# EAGLE board CFT-PB1 (EAGLE 5.11)
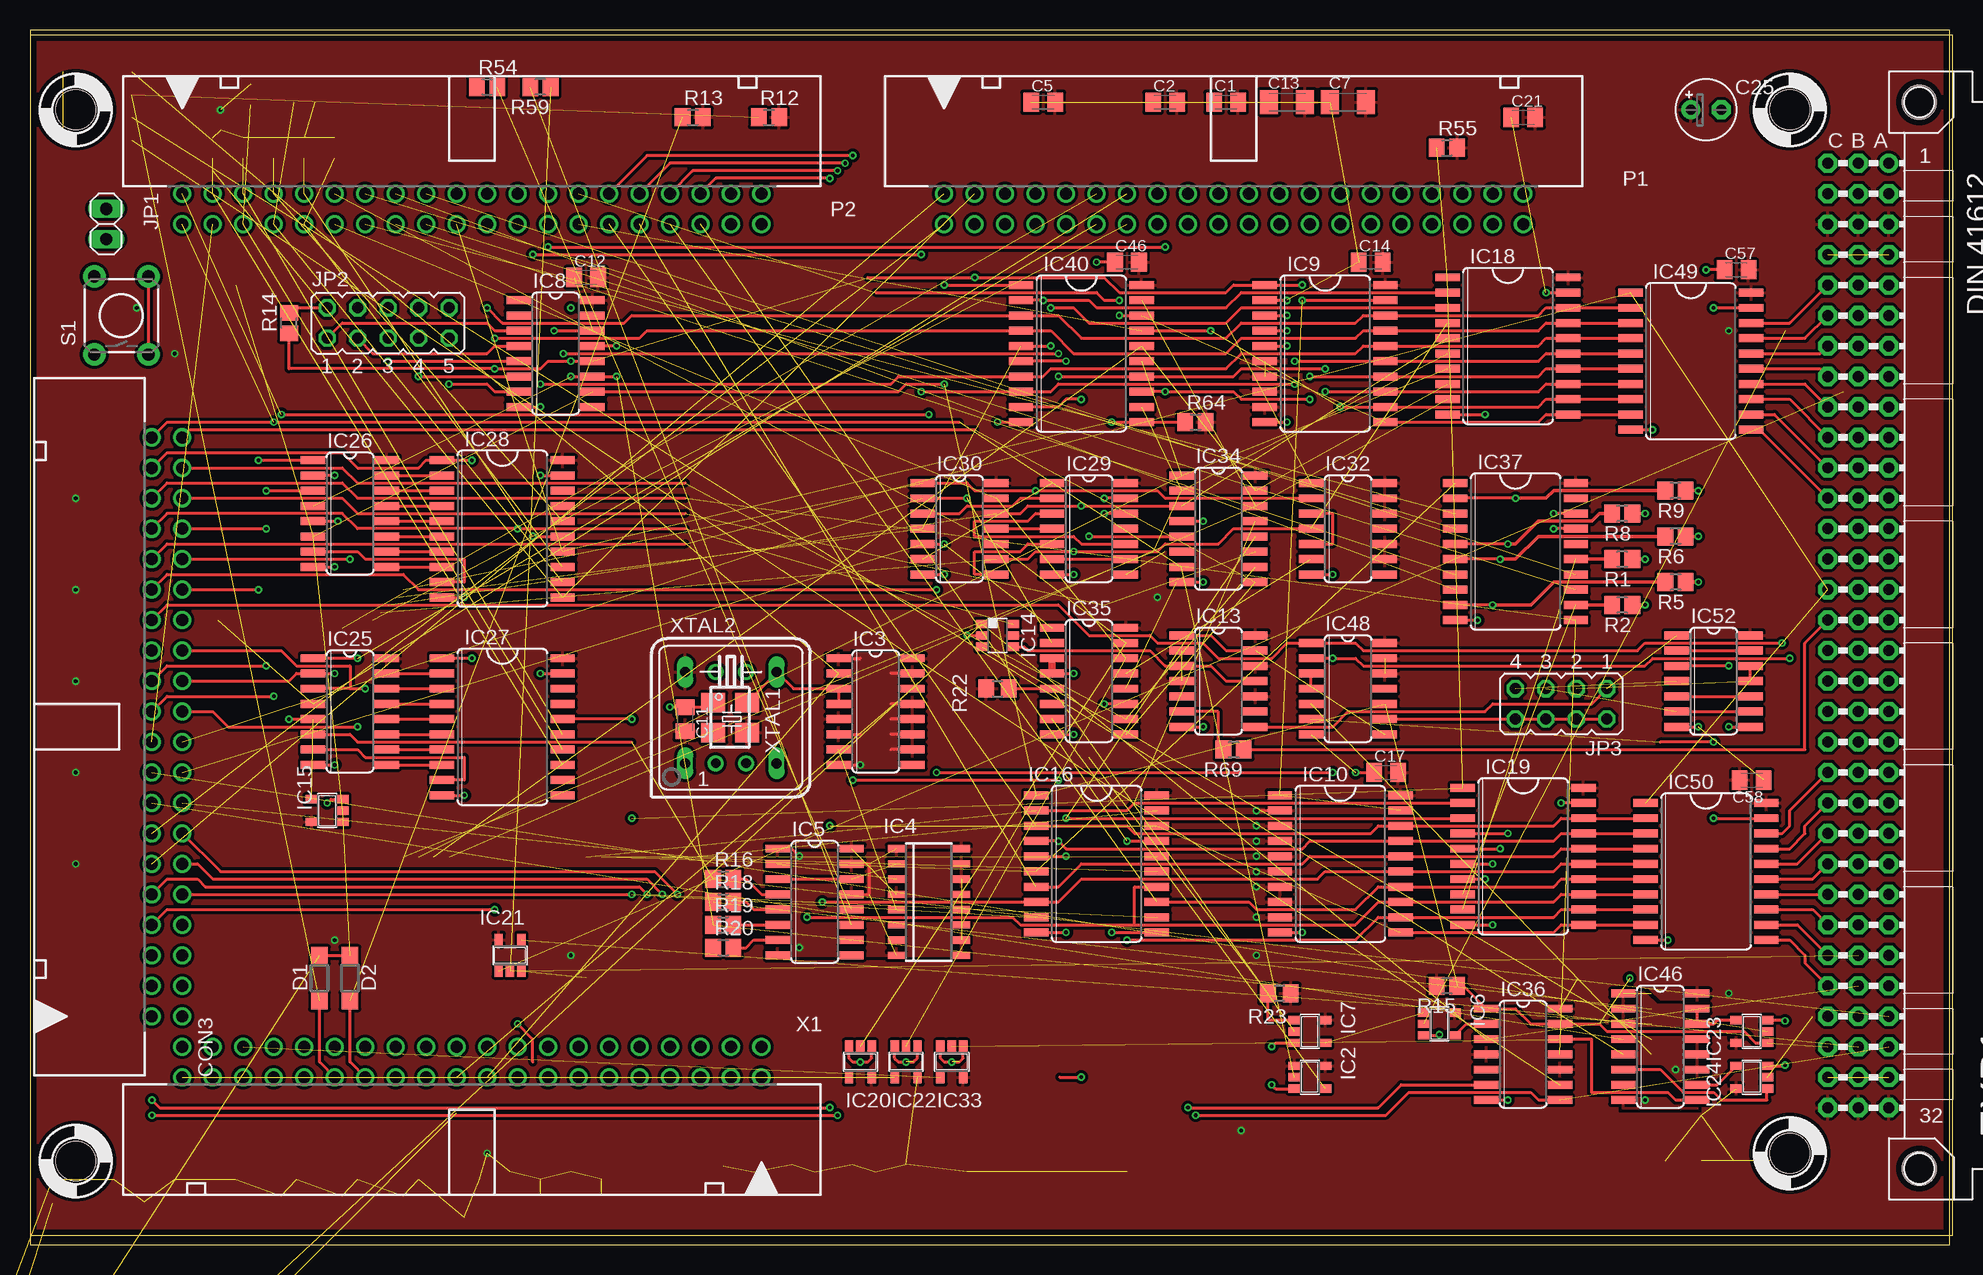
[diagram p11: board, top side]
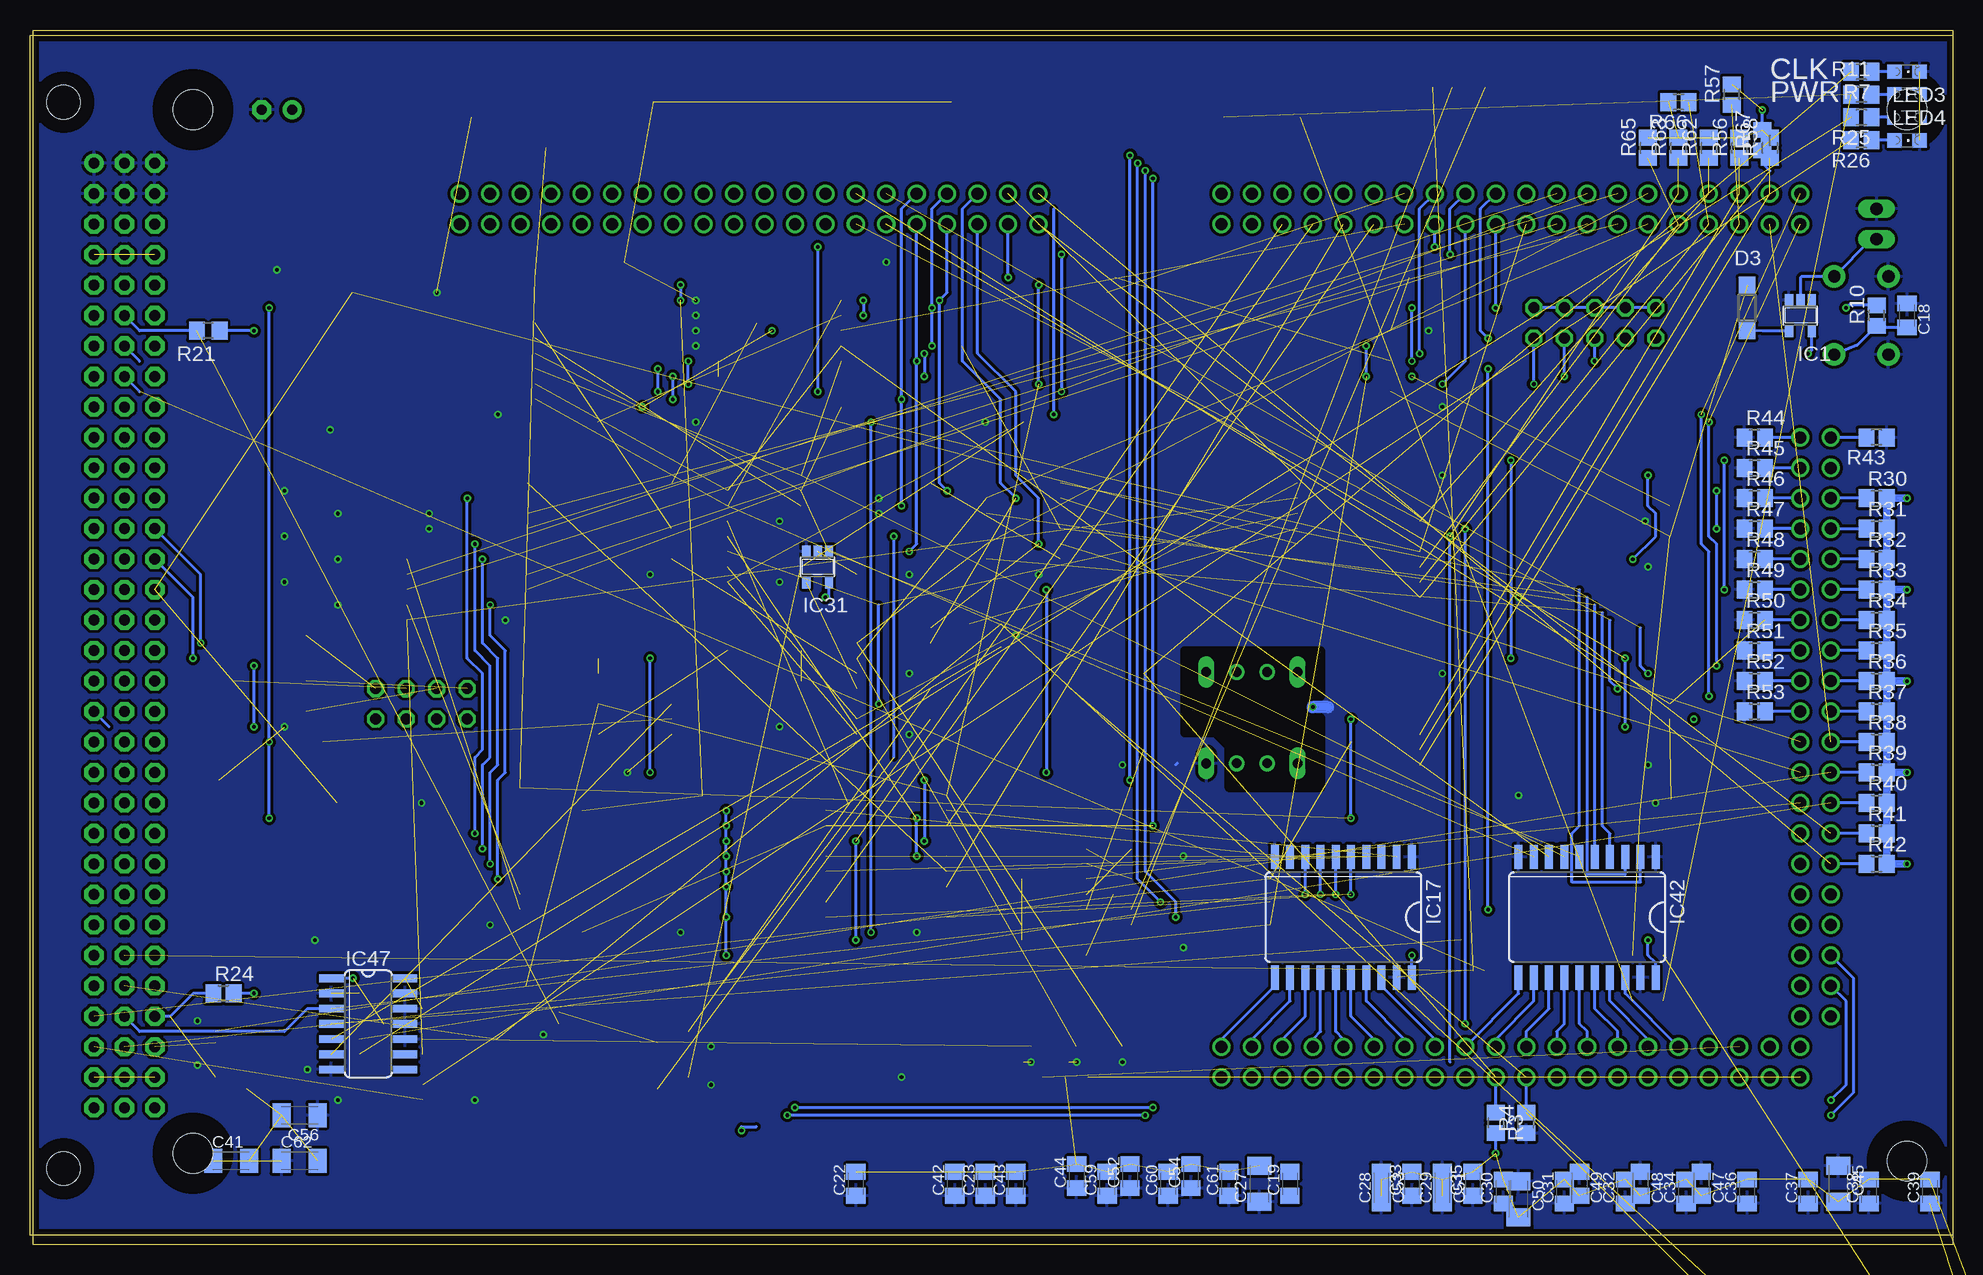
[diagram p12: board, bottom side, seen from below]

Size 160 x 101.27 mm. Coordinates in mm from the lower left corner, seen from the top.
Outline: 0,0 160,0 160,101.27 0,101.27 0,0
Copper layers (1*16): Top 0.035mm / dielectric 1.5mm / Bottom 0.035mm
Design rules "smart-prototyping": minimum track width 7mil, minimum drill 12mil, track to track 7mil, track to pad 7mil, pad to pad 7mil, via to via 7mil, smd to smd 0mil, copper to edge 20mil, drill to drill 10mil, minimum pad ring 10mil, minimum via ring 6mil, stop-mask expansion 2mil, vias tented up to drill 25mil, thermal gap 10mil
Net classes: 0 default: width 0.152 mm, clearance 0.152 mm; 1 low power: width 0.305 mm, clearance 0.152 mm; 2 LED power: width 0.406 mm, clearance 0.254 mm
bKeepout: area 52.7,38.1 to 64.1,49.5
bRestrict: area 52.7,38.1 to 64,49.5

## Footprints (pad centres in the part's own frame; a part is rotated, then mirrored left to right if it is on the bottom)
C0805K = smd 1.3 x 1.6: 1 -1,0; 2 1,0
C1206K = smd 1.5 x 2: 1 -1.5,0; 2 1.5,0
E2,5-5 = drill 0.813 pad 1.6 round: + -1.27,0 | drill 0.813 pad 1.6 octagon: - 1.27,0
PAK100/2500-5-40 = drill 1 pad 1.422 round: 1 -24.13,-1.27; 2 -24.13,1.27; 3 -21.59,-1.27; 4 -21.59,1.27; 5 -19.05,-1.27; 6 -19.05,1.27; 7 -16.51,-1.27; 8 -16.51,1.27; 9 -13.97,-1.27; 10 -13.97,1.27; 11 -11.43,-1.27; 12 -11.43,1.27; 13 -8.89,-1.27; 14 -8.89,1.27; 15 -6.35,-1.27; 16 -6.35,1.27; 17 -3.81,-1.27; 18 -3.81,1.27; 19 -1.27,-1.27; 20 -1.27,1.27; 21 1.27,-1.27; 22 1.27,1.27; 23 3.81,-1.27; 24 3.81,1.27; 25 6.35,-1.27; 26 6.35,1.27; 27 8.89,-1.27; 28 8.89,1.27; 29 11.43,-1.27; 30 11.43,1.27; 31 13.97,-1.27; 32 13.97,1.27; 33 16.51,-1.27; 34 16.51,1.27; 35 19.05,-1.27; 36 19.05,1.27; 37 21.59,-1.27; 38 21.59,1.27; 39 24.13,-1.27; 40 24.13,1.27
SOD123 = smd 1.4 x 1.4: A 1.9,0; C -1.9,0
VG96K = drill 0.914 pad 1.6 round: A1 154.94,39.37 | drill 0.914 pad 1.6 octagon: A2 154.94,36.83; A3 154.94,34.29; A4 154.94,31.75; A5 154.94,29.21; A6 154.94,26.67; A7 154.94,24.13; A8 154.94,21.59; A9 154.94,19.05; A10 154.94,16.51; A11 154.94,13.97; A12 154.94,11.43; A13 154.94,8.89; A14 154.94,6.35; A15 154.94,3.81; A16 154.94,1.27; A17 154.94,-1.27; A18 154.94,-3.81; A19 154.94,-6.35; A20 154.94,-8.89; A21 154.94,-11.43; A22 154.94,-13.97; A23 154.94,-16.51; A24 154.94,-19.05; A25 154.94,-21.59; A26 154.94,-24.13; A27 154.94,-26.67; A28 154.94,-29.21; A29 154.94,-31.75; A30 154.94,-34.29; A31 154.94,-36.83; A32 154.94,-39.37; B1 152.4,39.37; B2 152.4,36.83; B3 152.4,34.29; B4 152.4,31.75; B5 152.4,29.21; B6 152.4,26.67; B7 152.4,24.13; B8 152.4,21.59; B9 152.4,19.05; B10 152.4,16.51; B11 152.4,13.97; B12 152.4,11.43; B13 152.4,8.89; B14 152.4,6.35; B15 152.4,3.81; B16 152.4,1.27; B17 152.4,-1.27; B18 152.4,-3.81; B19 152.4,-6.35; B20 152.4,-8.89; B21 152.4,-11.43; B22 152.4,-13.97; B23 152.4,-16.51; B24 152.4,-19.05; B25 152.4,-21.59; B26 152.4,-24.13; B27 152.4,-26.67; B28 152.4,-29.21; B29 152.4,-31.75; B30 152.4,-34.29; B31 152.4,-36.83; B32 152.4,-39.37; C1 149.86,39.37; C2 149.86,36.83; C3 149.86,34.29; C4 149.86,31.75; C5 149.86,29.21; C6 149.86,26.67; C7 149.86,24.13; C8 149.86,21.59; C9 149.86,19.05; C10 149.86,16.51; C11 149.86,13.97; C12 149.86,11.43; C13 149.86,8.89; C14 149.86,6.35; C15 149.86,3.81; C16 149.86,1.27; C17 149.86,-1.27; C18 149.86,-3.81; C19 149.86,-6.35; C20 149.86,-8.89; C21 149.86,-11.43; C22 149.86,-13.97; C23 149.86,-16.51; C24 149.86,-19.05; C25 149.86,-21.59; C26 149.86,-24.13; C27 149.86,-26.67; C28 149.86,-29.21; C29 149.86,-31.75; C30 149.86,-34.29; C31 149.86,-36.83; C32 149.86,-39.37 | hole 2.794: 157.48,44.45; 157.48,-44.45
SOT23-5 = smd 0.69 x 0.99: 1 -0.95,-1.29; 2 0,-1.29; 3 0.95,-1.29; 4 0.95,1.3; 5 -0.95,1.3
SO16 = smd 0.66 x 2.032: 1 -4.445,-3.073; 2 -3.175,-3.073; 3 -1.905,-3.073; 4 -0.635,-3.073; 5 0.635,-3.073; 6 1.905,-3.073; 7 3.175,-3.073; 8 4.445,-3.073; 9 4.445,3.073; 10 3.175,3.073; 11 1.905,3.073; 12 0.635,3.073; 13 -0.635,3.073; 14 -1.905,3.073; 15 -3.175,3.073; 16 -4.445,3.073
SO16D = smd 0.6 x 1.4: 1 -4.445,-2.715; 2 -3.175,-2.715; 3 -1.905,-2.715; 4 -0.635,-2.715; 5 0.635,-2.715; 6 1.905,-2.715; 7 3.175,-2.715; 8 4.445,-2.715; 9 4.445,2.715; 10 3.175,2.715; 11 1.905,2.715; 12 0.635,2.715; 13 -0.635,2.715; 14 -1.905,2.715; 15 -3.175,2.715; 16 -4.445,2.715
SO20W = smd 0.66 x 2.032: 1 -5.715,-5.029; 2 -4.445,-5.029; 3 -3.175,-5.029; 4 -1.905,-5.029; 5 -0.635,-5.029; 6 0.635,-5.029; 7 1.905,-5.029; 8 3.175,-5.029; 9 4.445,-5.029; 10 5.715,-5.029; 11 5.715,5.029; 12 4.445,5.029; 13 3.175,5.029; 14 1.905,5.029; 15 0.635,5.029; 16 -0.635,5.029; 17 -1.905,5.029; 18 -3.175,5.029; 19 -4.445,5.029; 20 -5.715,5.029
SO14 = smd 0.66 x 2.032: 1 -3.81,-3.073; 2 -2.54,-3.073; 3 -1.27,-3.073; 4 0,-3.073; 5 1.27,-3.073; 6 2.54,-3.073; 7 3.81,-3.073; 8 3.81,3.073; 9 2.54,3.073; 10 1.27,3.073; 11 0,3.073; 12 -1.27,3.073; 13 -2.54,3.073; 14 -3.81,3.073
DBV_R-PDSO-G6 = smd 0.69 x 0.99: 1 -0.95,-1.29; 2 0,-1.29; 3 0.95,-1.29; 4 0.95,1.3; 5 0,1.3; 6 -0.95,1.3
1X02 = drill 1.016 long: 1 -1.27,0; 2 1.27,0
JP5Q = drill 0.914 octagon: 1 -5.08,-1.27; 2 -5.08,1.27; 3 -2.54,-1.27; 4 -2.54,1.27; 5 0,-1.27; 6 0,1.27; 7 2.54,-1.27; 8 2.54,1.27; 9 5.08,-1.27; 10 5.08,1.27
JP4Q = drill 0.914 octagon: 1 -3.81,-1.27; 2 -3.81,1.27; 3 -1.27,-1.27; 4 -1.27,1.27; 5 1.27,-1.27; 6 1.27,1.27; 7 3.81,-1.27; 8 3.81,1.27
CHIPLED_0805 = smd 1.2 x 1.2: A 0,-1.05; C 0,1.05
R0805 = smd 1.3 x 1.5: 1 -0.85,0; 2 0.85,0
R0805' = smd 1.3 x 1.5: 1 -0.95,0; 2 0.95,0
TACTILE-PTH = drill 1.016 pad 1.88 round: 1 -3.251,2.261; 2 3.251,2.261; 3 -3.251,-2.261; 4 3.251,-2.261
STANDOFF_28_60 = hole 3.302: 0,0
CRYSTAL-SMD-5X3.2MM = smd 1.6 x 2: 1 1.125,-1.475; 2 -1.375,-1.475; 3 -1.375,1.35; 4 1.125,1.35
DIL08S-SOCKET = drill 0.813 long: 1 -3.81,-3.81; 4 3.81,-3.81; 5 3.81,3.81; 8 -3.81,3.81 | drill 0.8 round: 2 -1.27,-3.81; 3 1.27,-3.81; 6 1.27,3.81; 7 -1.27,3.81

## Placement (x,y rotation side)
$4_37_$  SIGNATURESILK  [SIGNATURE]  30.48,-15.88 0 top  (outside the outline)
$4_39_$  OSHW-LOGOL  [OSHW-LOGO-L]  44.45,-10.79 0 top  (outside the outline)
$4_39_$1  OSHW-LOGOL  [OSHW-LOGO-L]  53.34,-10.79 0 top  (outside the outline)
$4_40_$  QRCODE-CFT  [CFT-QRCODE]  3.81,-24.77 0 top  (outside the outline)
C1  0.1uF  [C0805K]  99.69,95.25 0 top
C2  0.1uF  [C0805K]  94.61,95.25 0 top
C5  0.1uF  [C0805K]  84.45,95.25 0 top
C7  1uF  [C1206K]  109.86,95.25 0 top
C11  0.1uF  [C0805K]  54.61,43.82 270 top
C12  0.1uF  [C0805K]  46.35,80.64 0 top
C13  1uF  [C1206K]  104.78,95.25 0 top
C14  0.1uF  [C0805K]  111.76,81.91 0 top
C17  0.1uF  [C0805K]  113.03,39.37 0 top
C18  0.1uF  [C0805K]  3.81,77.47 270 bottom
C19  0.1uF  [C0805K]  55.24,5.08 90 bottom
C21  0.1uF  [C0805K]  124.46,93.98 0 top
C22  0.1uF  [C0805K]  91.44,5.08 90 bottom
C23  0.1uF  [C0805K]  80.64,5.08 90 bottom
C25  1uF  [E2,5-5]  139.7,94.61 0 top
C27  1uF  [C1206K]  57.78,5.08 90 bottom
C28  0.1uF  [C0805K]  47.62,4.45 90 bottom
C29  0.1uF  [C0805K]  42.55,4.45 90 bottom
C30  0.1uF  [C0805K]  37.47,4.45 90 bottom
C31  0.1uF  [C0805K]  32.38,4.45 90 bottom
C32  0.1uF  [C0805K]  27.3,4.45 90 bottom
C33  0.1uF  [C0805K]  45.09,5.08 90 bottom
C34  0.1uF  [C0805K]  22.23,4.45 90 bottom
C35  0.1uF  [C0805K]  40.01,5.08 90 bottom
C36  0.1uF  [C0805K]  17.14,4.45 90 bottom
C37  0.1uF  [C0805K]  12.06,4.45 90 bottom
C38  0.1uF  [C0805K]  6.99,4.45 90 bottom
C39  0.1uF  [C0805K]  1.91,4.45 90 bottom
C41  1uF  [C1206K]  143.51,6.98 0 bottom
C42  0.1uF  [C0805K]  83.19,5.08 90 bottom
C43  0.1uF  [C0805K]  78.11,5.08 90 bottom
C44  0.1uF  [C0805K]  73.03,5.71 90 bottom
C45  1uF  [C1206K]  9.53,5.08 270 bottom
C46  0.1uF  [C0805K]  91.44,81.91 0 top
C47  0.1uF  [C0805K]  20.95,5.08 270 bottom
C48  0.1uF  [C0805K]  26.04,5.08 270 bottom
C49  0.1uF  [C0805K]  31.11,5.08 270 bottom
C50  1uF  [C1206K]  36.2,3.81 270 bottom
C51  0.1uF  [C0805K]  42.55,5.08 270 bottom
C52  0.1uF  [C0805K]  68.58,5.71 90 bottom
C53  0.1uF  [C0805K]  47.62,5.08 270 bottom
C54  0.1uF  [C0805K]  63.5,5.71 90 bottom
C56  1uF  [C1206K]  137.79,10.79 180 bottom
C57  0.1uF  [C0805K]  142.24,81.28 0 top
C58  0.1uF  [C0805K]  143.51,38.74 180 top
C59  0.1uF  [C0805K]  70.48,5.08 90 bottom
C60  0.1uF  [C0805K]  65.41,5.08 90 bottom
C61  0.1uF  [C0805K]  60.33,5.08 90 bottom
C62  1uF  [C1206K]  137.79,6.98 0 bottom
CON3  2540-5  [PAK100/2500-5-40]  11.43,43.18 90 top
D1  [SOD123]  24.13,22.22 90 top
D2  [SOD123]  26.67,22.22 90 top
D3  [SOD123]  17.14,78.1 90 bottom
EXP1  [VG96K]  0,50.8 0 top
IC1  74AHC1G14DBV  [SOT23-5]  12.7,77.47 180 bottom
IC2  74AHC1G00DBV  [SOT23-5]  106.68,13.97 270 top
IC3  74HC253D  [SO16]  70.48,44.45 270 top
IC4  74HC193D  [SO16D]  74.93,28.57 270 top
IC5  74HC139D  [SO16]  65.41,28.57 270 top
IC6  74AHC1G00DBV  [SOT23-5]  117.47,18.41 270 top
IC7  74AHC1G00DBV  [SOT23-5]  106.68,17.78 270 top
IC8  74HC590D  [SO16]  43.81,74.3 270 top
IC9  74HC541DW  [SO20W]  107.95,74.3 270 top
IC10  74HC541DW  [SO20W]  109.22,31.75 270 top
IC11  74HC74D  [SO14]  -6.99,-31.11 0 top  (outside the outline)
IC12  74AHC1G08DBV  [SOT23-5]  -10.79,-40.64 0 top  (outside the outline)
IC13  74HC74D  [SO14]  99.06,46.99 270 top
IC14  74AC1G27DBV  [DBV_R-PDSO-G6]  80.64,50.8 270 top
IC15  74AHC1G04DBV  [SOT23-5]  24.77,36.2 90 top
IC16  74HC273DW  [SO20W]  88.9,31.75 270 top
IC17  74HC541DW  [SO20W]  50.8,27.3 180 bottom
IC18  74HC541DW  [SO20W]  123.19,74.93 270 top
IC19  74HC541DW  [SO20W]  124.46,32.38 270 top
IC20  74AHC1G125DBV  [SOT23-5]  69.22,15.24 180 top
IC21  74AHC1G32DBV  [SOT23-5]  40.01,24.13 0 top
IC22  74AHC1G125DBV  [SOT23-5]  73.03,15.24 180 top
IC23  74AHC1G08DBV  [SOT23-5]  143.51,17.78 90 top
IC24  74AHC1G32DBV  [SOT23-5]  143.51,13.97 90 top
IC25  74HC138D  [SO16]  26.67,44.45 270 top
IC26  74HC138D  [SO16]  26.67,60.96 270 top
IC27  74HC541DW  [SO20W]  39.37,43.18 270 top
IC28  74HC541DW  [SO20W]  39.37,59.69 270 top
IC29  74HC32D  [SO14]  88.27,59.69 270 top
IC30  74HC08D  [SO14]  77.47,59.69 270 top
IC31  74AHC1G86DBV  [SOT23-5]  94.61,56.52 180 bottom
IC32  74HC32D  [SO14]  109.86,59.69 270 top
IC33  74AHC1G125DBV  [SOT23-5]  76.83,15.24 180 top
IC34  74HC251D  [SO16]  99.06,59.69 270 top
IC35  74HC251D  [SO16]  88.27,46.99 270 top
IC36  74HC74D  [SO14]  124.46,15.88 270 top
IC37  74HC374DW  [SO20W]  123.83,57.79 270 top
IC40  74HC273DW  [SO20W]  87.63,74.3 270 top
IC42  74HC541DW  [SO20W]  30.48,27.3 180 bottom
IC46  74HC112D  [SO16]  135.89,16.51 270 top
IC47  74HC74D  [SO14]  132.08,18.41 270 bottom
IC48  74HC08D  [SO14]  109.86,46.36 270 top
IC49  74HC245DW  [SO20W]  138.43,73.66 270 top
IC50  74HC245DW  [SO20W]  139.7,31.11 270 top
IC52  74AC04D  [SO14]  140.34,46.99 270 top
JP1  [1X02]  6.35,85.09 270 top
JP2  [JP5Q]  29.84,76.83 0 top
JP3  [JP4Q]  127.64,45.09 180 top
LED1  LED-5MM-GREEN  [CHIPLED_0805]  3.81,97.79 270 bottom
LED2  LED-5MM-GREEN  [CHIPLED_0805]  3.81,95.88 270 bottom
LED3  LED-5MM-GREEN  [CHIPLED_0805]  3.81,93.98 270 bottom
LED4  LED-5MM-GREEN  [CHIPLED_0805]  3.81,92.08 270 bottom
P1  2540-5  [PAK100/2500-5-40]  100.33,86.36 0 top
P2  2540-5  [PAK100/2500-5-40]  36.83,86.36 0 top
R1  4k7  [R0805]  132.72,57.15 180 top
R2  4k7  [R0805]  132.72,53.34 180 top
R3  4k7  [R0805]  38.1,10.16 270 bottom
R4  4k7  [R0805]  35.56,10.16 90 bottom
R5  4k7  [R0805]  137.16,55.25 180 top
R6  4k7  [R0805]  137.16,59.05 180 top
R7  330R  [R0805]  7.62,97.79 180 bottom
R8  4k7  [R0805]  132.72,60.96 180 top
R9  4k7  [R0805]  137.16,62.87 180 top
R10  50k  [R0805]  6.35,77.47 90 bottom
R11  330R  [R0805]  7.62,95.88 180 bottom
R12  4k7  [R0805]  61.59,93.98 0 top
R13  4k7  [R0805]  55.24,93.98 0 top
R14  30R  [R0805]  21.59,76.83 90 top
R15  4k7  [R0805]  118.11,21.59 180 top
R16  30R  [R0805]  57.78,30.48 0 top
R18  30R  [R0805]  57.78,28.57 0 top
R19  30R  [R0805]  57.78,26.67 0 top
R20  30R  [R0805]  57.78,24.77 0 top
R21  4k7  [R0805']  145.41,76.2 180 bottom
R22  4k7  [R0805']  80.64,46.36 0 top
R23  4k7  [R0805']  104.14,20.95 180 top
R24  4k7  [R0805]  144.15,20.95 0 bottom
R25  330R  [R0805]  7.62,93.98 180 bottom
R26  330R  [R0805]  7.62,92.08 180 bottom
R30  4k7  [R0805]  6.35,62.23 0 bottom
R31  4k7  [R0805]  6.35,59.69 0 bottom
R32  4k7  [R0805]  6.35,57.15 0 bottom
R33  4k7  [R0805]  6.35,54.61 0 bottom
R34  4k7  [R0805]  6.35,52.07 0 bottom
R35  4k7  [R0805]  6.35,49.53 0 bottom
R36  4k7  [R0805]  6.35,46.99 0 bottom
R37  4k7  [R0805]  6.35,44.45 0 bottom
R38  4k7  [R0805]  6.35,41.91 0 bottom
R39  4k7  [R0805]  6.35,39.37 0 bottom
R40  4k7  [R0805]  6.35,36.83 0 bottom
R41  4k7  [R0805]  6.35,34.29 0 bottom
R42  4k7  [R0805]  6.35,31.75 0 bottom
R43  4k7  [R0805]  6.35,67.31 180 bottom
R44  4k7  [R0805]  16.51,67.31 0 bottom
R45  4k7  [R0805]  16.51,64.77 0 bottom
R46  4k7  [R0805]  16.51,62.23 0 bottom
R47  4k7  [R0805]  16.51,59.69 0 bottom
R48  4k7  [R0805]  16.51,57.15 0 bottom
R49  4k7  [R0805]  16.51,54.61 0 bottom
R50  4k7  [R0805]  16.51,52.07 0 bottom
R51  4k7  [R0805]  16.51,49.53 0 bottom
R52  4k7  [R0805]  16.51,46.99 0 bottom
R53  4k7  [R0805]  16.51,44.45 0 bottom
R54  30R  [R0805]  38.1,96.52 0 top
R55  4k7  [R0805]  118.11,91.44 0 top
R56  4k7  [R0805]  17.78,91.44 90 bottom
R57  4k7  [R0805]  18.41,95.88 90 bottom
R58  4k7  [R0805]  15.24,91.44 90 bottom
R59  30R  [R0805]  42.55,96.52 180 top
R62  4k7  [R0805]  20.32,91.44 90 bottom
R63  4k7  [R0805]  22.86,91.44 90 bottom
R64  4k7  [R0805]  97.16,68.58 0 top
R65  4k7  [R0805]  25.4,91.44 90 bottom
R66  4k7  [R0805]  22.86,95.25 180 bottom
R67  4k7  [R0805]  15.88,92.08 90 bottom
R69  30R  [R0805]  100.33,41.28 180 top
S1  [TACTILE-PTH]  7.62,77.47 90 top
U1  HOLE  [STANDOFF_28_60]  3.81,94.61 0 top
U2  HOLE  [STANDOFF_28_60]  3.81,6.98 0 top
U3  HOLE  [STANDOFF_28_60]  146.69,7.62 0 top
U4  HOLE  [STANDOFF_28_60]  146.69,94.61 0 top
X1  2540-5  [PAK100/2500-5-40]  36.83,15.24 180 top
XTAL1  16.000MHz  [CRYSTAL-SMD-5X3.2MM]  58.42,43.82 270 top
XTAL2  16.000MHz  [DIL08S-SOCKET]  58.42,43.94 0 top

## Tracks (layer width: path | path; a pad name or v marks a point on that pad's centre or on a via)
!BUSEN  (via drill 0.3)  (1 unrouted)
  Top 0.254: v140.34,41.91 135.89,41.91 | v140.34,35.56 IC50.19 | v140.34,78.1 IC49.19
  Bottom 0.254: v140.34,35.56 v140.34,41.91 v140.34,78.1
!CLI  (1 unrouted)
  Bottom 0.254: R39.1 CON3.18
!CLL  (1 unrouted)
  Bottom 0.254: R41.1 CON3.14
!CPL  (1 unrouted)
  Bottom 0.254: R42.1 CON3.12
!DEC
  Bottom 0.254: R35.1 CON3.26
!EN0
  Top 0.254: IC48.4 IC48.3
!END  (2 unrouted)
  Top 0.254: CON3.36 11.43,63.5 26.04,63.5 27.3,62.23 54.61,62.23
  Bottom 0.254: R30.1 CON3.36
!ENDEXT
  Bottom 0.254: 151.13,73.66 EXP1.B7
!FINT
  Top 0.254: IC46.6 135.89,14.61 137.79,12.7 140.34,12.7 140.97,12.06 144.78,12.06 144.78,13 IC24.1
!FPRESET  (1 unrouted)
  Top 0.254: X1.28 26.67,15.24 D2.C
!HALT
  Bottom 0.254: 153.67,43.18 EXP1.A19
!INCPC  (1 unrouted)
  Bottom 0.254: R38.1 CON3.20
!IO  (via drill 0.3)
  Top 0.254: CON3.30 11.43,55.88 31.11,55.88 32.38,54.61 v75.56,54.61 | v75.56,39.37 v108.58,39.37 | IC48.2 v108.58,48.9 110.49,48.9 111.12,48.26 134.62,48.26 135.25,48.9 v146.69,48.9
  Bottom 0.254: R33.1 CON3.30 | v75.56,54.61 v75.56,39.37 | v108.58,39.37 v108.58,48.9 | v146.69,48.9 146.69,53.98 EXP1.C14
!IRQ  (1 unrouted)
  Bottom 0.254: R24.1 146.69,20.95 148.59,19.05 EXP1.C29
!IRQS  (via drill 0.3)  (1 unrouted)
  Top 0.254: IC36.8 125.73,12.06 125.09,12.7 114.94,12.7 113.03,10.79 v97.16,10.79 | v10.16,10.79 v67.31,10.79
  Bottom 0.254: v10.16,10.79 8.26,12.7 8.26,22.22 CON3.6 | v67.31,10.79 v97.16,10.79
!MASKEDIRQ
  Top 0.254: IC46.10 140.62,13.33 IC24.4
!MEM  (via drill 0.3)
  Top 0.254: CON3.28 11.43,53.34 85.72,53.34 88.27,50.8 93.34,50.8 93.98,50.17 97.79,50.17 99.06,48.9 103.5,48.9 104.78,50.17 IC48.1 110.49,50.17 111.12,49.53 133.99,49.53 134.62,50.17 v146.05,50.17
  Bottom 0.254: R34.1 CON3.28 | v146.05,50.17 146.05,55.88 EXP1.C13
!OPIF3  (1 unrouted)
!R  (3 unrouted)
  Top 0.254: CON3.32 11.43,58.42 54.61,58.42
  Bottom 0.254: R32.1 CON3.32
!RAC  (2 unrouted)
!RAGL  (via drill 0.3)  (3 unrouted)
  Top 0.254: v50.16,43.82 IC27.16
  Bottom 0.254: v50.16,35.56 v50.16,43.82
!RDR  (2 unrouted)
!RESET  (via drill 0.3)  (12 unrouted)
  Top 0.254: IC23.1 143.82,16.83 142.88,17.78 131.44,17.78 130.81,18.41 IC36.13 125.09,18.41 123.83,19.68 IC36.1 119.48,21.59 R15.1 | v76.2,80.01 IC40.1 | D1.A D2.A | IC8.10 72.39,71.12 73.03,71.75 v76.2,71.75
  Bottom 0.254: v76.2,71.75 v76.2,80.01 | v133.35,22.22 IC47.1
!RESET_OR_CLI
  Top 0.254: IC46.15 IC46.14 140.34,18.41 140.65,18.73 IC23.4
!RPC  (2 unrouted)
!RSTHOLD  (via drill 0.3)  (3 unrouted)
  Top 0.254: v106.05,80.01 IC9.1 100.33,80.01 99.69,79.38 90.81,79.38 89.53,80.64 v78.74,80.64 69.85,80.64 | v106.05,78.74 IC9.19 | IC8.12 v45.09,73.66 43.18,73.66 42.55,73.02 v38.73,73.02 21.59,73.02 R14.1 21.38,76.2 | CON3.8 11.43,27.94 v38.73,27.94
  Bottom 0.254: v106.05,80.01 v106.05,78.74 | v45.09,73.66 v45.09,78.1 | v78.74,80.64 P1.3 | v38.73,27.94 v38.73,73.02
!RUEN  (via drill 0.3)  (1 unrouted)
  Top 0.254: v21.59,43.82 IC25.5
!SKIP  (via drill 0.3)
  Top 0.254: v10.16,12.06 10.79,11.43 v66.67,11.43 | IC36.6 114.3,13.33 112.39,11.43 v96.52,11.43
  Bottom 0.254: CON3.4 8.89,20.32 8.89,13.33 v10.16,12.06 | v66.67,11.43 v96.52,11.43
!SKIPEXT  (1 unrouted)
  Bottom 0.254: R21.2 151.13,76.2 EXP1.B6
!STI  (1 unrouted)
  Bottom 0.254: R40.1 CON3.16
!STPAC  (via drill 0.3)  (1 unrouted)
  Top 0.254: CON3.24 11.43,48.26 v19.68,48.26
  Bottom 0.254: R36.1 CON3.24 | v19.68,48.26 19.68,58.42 20.32,59.05 v20.32,68.58
!STPDR  (via drill 0.3)  (1 unrouted)
  Top 0.254: CON3.22 11.43,45.72 v20.32,45.72 | v20.95,69.21 v74.93,69.21
  Bottom 0.254: R37.1 CON3.22 | v20.32,45.72 20.32,57.79 20.95,58.42 v20.95,69.21 | v74.93,69.21 74.93,86.36
!T34  (2 unrouted)
!UCE  (via drill 0.3)
  Top 0.254: CON3.38 11.43,66.04 26.04,66.04 27.3,64.77 32.38,64.77 33.02,65.41 IC28.1 v36.83,65.41 | v36.83,48.9 IC27.1
  Bottom 0.254: v36.83,65.41 v36.83,48.9
!W
  Top 0.254: R69.1 147.96,41.28 147.96,50.17 EXP1.C16
!WAC  (2 unrouted)
!WAITING  (1 unrouted)
!WALU  (2 unrouted)
  Bottom 0.254: R67.1 15.88,90.17 15.24,89.53
!WAR  (2 unrouted)
!WCLR  (1 unrouted)
  Top 0.254: IC13.8 108.58,43.18 109.86,44.45 121.28,44.45 121.92,45.09 130.18,45.09 JP3.1
!WDR  (2 unrouted)
!WEN  (via drill 0.3)  (1 unrouted)
  Top 0.254: CON3.34 11.43,60.96 26.04,60.96 27.3,59.69 v40.64,59.69 54.61,59.69 | 41.91,15.24 41.91,17.14 v40.64,18.41
  Bottom 0.254: CON3.34 R31.1 | v40.64,18.41 v40.64,59.69
!WIR  (via drill 0.3)  (2 unrouted)
  Top 0.254: R64.1 IC40.11 v90.17,68.58 | v90.17,26.04 IC16.11
  Bottom 0.254: v90.17,26.04 v90.17,68.58
!WPC  (via drill 0.3)  (2 unrouted)
  Top 0.254: v41.91,59.05 IC28.15
  Bottom 0.254: 41.91,15.24 v41.91,59.05
!WS  (1 unrouted)
  Bottom 0.254: 151.13,71.12 EXP1.B8
+3.3V  (2 unrouted)
+12V  (2 unrouted)
BFIRQ  (1 unrouted)
BFNEG  (1 unrouted)
BFZERO  (1 unrouted)
CLK1  (2 unrouted)
  Top 0.254: IC25.6 26.67,42.55 27.3,41.91 50.16,41.91
CLK2  (1 unrouted)
  Bottom 0.254: EXP1.B29 151.13,17.78 139.06,17.78 137.16,19.68 IC47.3
CLK3  (via drill 0.3)  (3 unrouted)
  Top 0.254: v48.9,74.93 IC8.13 | v48.9,72.39 IC8.11 v45.09,72.39
  Bottom 0.254: v48.9,72.39 v48.9,74.93
CLK4  (4 unrouted)
DB0
  Top 0.254: IC49.18 146.69,76.83 EXP1.C5
DB1
  Top 0.254: IC49.17 147.96,75.56 EXP1.C6
DB2
  Top 0.254: IC49.16 149.22,74.3 EXP1.C7
DB3
  Top 0.254: IC49.15 149.22,73.02 EXP1.C8
DB4
  Top 0.254: IC49.14 147.96,71.75 EXP1.C9
DB5
  Top 0.254: IC49.13 146.69,70.48 EXP1.C10
DB6
  Top 0.254: IC49.12 145.41,69.21 EXP1.C11
DB7
  Top 0.254: IC49.11 144.15,67.94 EXP1.C12
DB8
  Top 0.254: IC50.18 146.05,34.29 146.69,34.93 146.69,36.2 EXP1.C21
DB9
  Top 0.254: IC50.17 146.69,33.02 147.96,34.29 147.96,34.93 EXP1.C22
DB10
  Top 0.254: IC50.16 147.32,31.75 EXP1.C23
DB11
  Top 0.254: IC50.15 148.59,30.48 EXP1.C24
DB12
  Top 0.254: IC50.14 EXP1.C25
DB13
  Top 0.254: IC50.13 148.59,27.94 EXP1.C26
DB14
  Top 0.254: IC50.12 147.32,26.67 EXP1.C27
DB15
  Top 0.254: IC50.11 146.69,25.4 147.96,24.13 147.96,23.5 EXP1.C28
FASTCLK
  Top 0.254: 67.31,45.19 IC3.4 IC3.3 63.63,46.36 XTAL2.5 62.23,47.65 XTAL1.3
FINT  (1 unrouted)
FIRQ  (1 unrouted)
  Top 0.254: IC36.12 130.18,17.14 130.18,12.7 136.53,12.7 137.16,12.06 IC46.9
FL  (via drill 0.3)  (2 unrouted)
  Top 0.254: IC30.5 v76.2,58.42
  Bottom 0.254: v76.2,58.42 76.2,62.23 78.11,64.14 78.11,71.12 81.28,74.3 P1.5
FNEG  (3 unrouted)
FPCLKEN  (2 unrouted)
  Bottom 0.254: R3.1 X1.20
FPIR0
  Bottom 0.254: IC42.18 27.3,20.95 X1.31
FPIR1
  Bottom 0.254: IC42.17 28.57,20.32 25.4,17.14 X1.29
FPIR2
  Bottom 0.254: IC42.16 29.84,19.68 27.94,17.78 X1.27
FPIR3
  Bottom 0.254: IC42.15 31.11,18.41 30.48,17.78 X1.25
FPIR4
  Bottom 0.254: IC42.14 32.38,18.41 33.02,17.78 X1.23
FPIR5
  Bottom 0.254: IC42.13 33.66,19.68 35.56,17.78 X1.21
FPIR6
  Bottom 0.254: IC42.12 34.92,20.32 38.1,17.14 X1.19
FPIR7
  Bottom 0.254: IC42.11 36.2,20.95 X1.17
FPIR8
  Bottom 0.254: IC17.18 47.62,21.59 43.18,17.14 X1.15
FPIR9
  Bottom 0.254: IC17.17 48.9,20.32 45.72,17.14 X1.13
FPIR10
  Bottom 0.254: IC17.16 50.16,19.05 48.26,17.14 X1.11
FPIR11
  Bottom 0.254: X1.9 50.8,17.14 51.44,17.78 IC17.15
FPIR12
  Bottom 0.254: IC17.14 52.7,17.78 53.34,17.14 X1.7
FPIR13
  Bottom 0.254: IC17.13 53.98,19.05 55.88,17.14 X1.5
FPIR14
  Bottom 0.254: IC17.12 55.24,20.32 58.42,17.14 X1.3
FPIR15
  Bottom 0.254: IC17.11 56.52,21.59 60.96,17.14 X1.1
FPUSTEP  (2 unrouted)
  Bottom 0.254: R4.2 X1.22
FV  (via drill 0.3)  (2 unrouted)
  Top 0.254: IC30.2 v78.11,62.23
  Bottom 0.254: P1.6 82.55,86.36 82.55,73.66 79.38,70.48 79.38,63.5 v78.11,62.23
FZERO  (3 unrouted)
GND  (via drill 0.3)  (24 unrouted)
  Top 0.254: IC16.10 v86.36,26.04 | IC10.10 v106.05,26.04 | IC19.10 v121.92,26.67 | IC37.10 v120.65,52.07 | IC37.17 v127,59.69 | IC37.18 v127,60.96 | IC49.10 v135.25,67.94 | v126.36,79.38 IC18.19 | IC18.10 v121.28,69.21 | IC9.10 v104.78,68.58 | IC9.3 v104.78,77.47 | v80.64,68.58 IC40.10 | IC25.8 v25.4,40.01 | IC26.8 v25.4,56.52 | IC26.5 v25.65,60.33 | IC27.10 v36.2,37.47 | IC28.10 v36.2,53.98 | v42.55,64.14 IC28.19 | v42.55,47.62 IC27.19 | IC19.19 v127.64,36.83 | IC50.10 v136.53,25.4 | IC13.7 v97.79,43.18 | IC5.1 63.5,33.02 v64.14,32.38 | IC5.15 69.98,31.75 69.98,29.21 IC5.13 | IC8.8 v42.55,69.85 | v43.69,76.2 IC8.14 | IC9.5 v104.78,74.93 | IC9.2 v104.78,78.74 | IC9.4 v104.78,76.2 | IC35.8 v87,42.55 | IC36.7 v123.19,12.06 | IC23.3 146.24,18.73 v146.3,18.67 | IC32.7 v108.58,55.88 | IC30.7 v76.2,55.88 | IC29.7 v87,55.88 | IC34.8 v97.79,55.25 | IC34.4 v97.79,60.33 | IC29.12 v89.53,60.96 | IC29.13 v89.53,62.23 | IC35.4 v87,47.62 | IC7.3 103.83,16.83 v103.5,16.51 | IC2.3 103.82,13.02 v103.5,13.33 | IC6.3 117.47,17.46 v117.47,17.53 | IC24.3 146.24,14.92 v146.3,14.99 | IC52.7 v139.06,43.18 | XTAL1.2 56.57,44.82 C11.1 53.36,44.82 v53.34,44.83 | 85.83,13.97 v87.63,13.97 | IC20.3 68.27,15.55 68.58,15.24 v69.22,15.24 69.85,15.24 70.17,15.55 IC20.1 | IC22.3 72.08,15.55 72.39,15.24 73.66,15.24 73.97,15.55 IC22.1 | IC33.3 75.89,15.55 76.2,15.24 77.47,15.24 77.78,15.55 IC33.1 | IC3.8 v69.22,40.01 | IC3.6 69.22,42.55 | IC3.1 69.22,48.9 | IC3.15 71.75,47.62 | IC3.13 71.75,45.09 | IC3.12 71.75,43.82 | IC3.11 71.75,42.55 | IC3.10 71.75,41.28 | v78.11,50.8 IC14.2 | IC15.3 25.08,37.15 v24.77,36.83 | v110.49,39.37 C17.1 | C57.1 v139.7,81.28 | C46.1 v88.9,81.91
  Top 0.305: R1.1 v134.62,57.15 | R6.1 v139.06,59.05 | R9.1 v139.06,62.87 | R5.1 v139.06,55.25 | R2.1 v134.62,53.34 | R8.1 v134.62,60.96
  Top 0.61: IC35.3 IC35.4
  Bottom 0.254: 64.64,40.13 64.77,40.01
  Bottom 1.016: 52.07,44.83 v53.34,44.83
  other vias: 64.14,24.77 134.62,12.06 137.16,14.61 73.03,15.24 76.83,15.24
  pour Bottom (isolate 0.254, rank 6): 0,101.6 160.66,101.6 160.66,0.64 0,0.64
  pour Top (isolate 0.254, rank 3): 62.23,32.64 62.23,24.13 78.11,24.13 78.11,32.64
  pour Top (isolate 0.254, rank 3): 132.72,21.21 132.72,11.43 139.06,11.43 139.06,19.94 135.64,19.94 134.62,20.95
  pour Top (isolate 0.254): 67.18,49.28 73.91,49.28 73.91,39.75 67.18,39.75
IBUS0  (via drill 0.3)
  Top 0.254: IC49.2 IC18.18 126.36,78.1 125.73,77.47 IC9.18 111.12,77.47 110.49,76.83 100.97,76.83 99.69,75.56 87.63,75.56 85.72,77.47 IC40.3 50.16,77.47 49.53,76.83 39.37,76.83 v38.1,78.1
  Bottom 0.254: v38.1,78.1 P2.21
IBUS1  (via drill 0.3)
  Top 0.254: IC49.3 IC18.17 126.36,76.83 125.73,76.2 IC9.17 111.12,76.2 110.49,75.56 100.97,75.56 99.69,74.3 87,74.3 85.09,76.2 IC40.4 51.44,76.2 50.8,75.56 v38.73,75.56
  Bottom 0.254: v38.73,75.56 39.37,76.2 39.37,86.36 P2.22
IBUS2  (via drill 0.3)
  Top 0.254: IC49.4 IC18.16 126.36,75.56 125.73,74.93 IC9.16 111.12,74.93 110.49,74.3 100.97,74.3 99.69,73.02 85.09,73.02 84.45,72.39 IC40.7 72.39,72.39 71.75,71.75 v42.55,71.75
  Bottom 0.254: v42.55,71.75 40.64,73.66 P2.23
IBUS3  (via drill 0.3)
  Top 0.254: IC49.5 IC18.15 126.36,74.3 125.73,73.66 IC9.15 v105.41,73.66 | v105.41,71.75 85.72,71.75 85.09,71.12 IC40.8 v74.3,71.12 | v41.91,82.55 v74.3,82.55
  Bottom 0.254: v105.41,71.75 v105.41,73.66 | v74.3,82.55 v74.3,71.12 | v41.91,82.55 41.91,86.36 P2.24
IBUS4  (via drill 0.3)
  Top 0.254: IC49.6 IC18.14 126.36,73.02 125.73,72.39 IC9.14 v106.68,72.39 | v43.18,83.19 v94.61,83.19 | IC40.13 v94.61,71.12 100.33,71.12 100.97,70.48 v106.68,70.48
  Bottom 0.254: v43.18,83.19 P2.25 | v94.61,83.19 v94.61,71.12 | v106.68,70.48 v106.68,72.39
IBUS5  (via drill 0.3)
  Top 0.254: IC49.7 IC18.13 126.36,71.75 125.73,71.12 IC9.13 v107.95,71.12 | v107.95,73.02 100.97,73.02 100.33,72.39 IC40.14 v85.72,72.39 | v44.45,74.3 v85.72,74.3
  Bottom 0.254: v107.95,73.02 v107.95,71.12 | P2.26 44.45,86.36 v44.45,74.3 | v85.72,74.3 v85.72,72.39
IBUS6  (via drill 0.3)  (2 unrouted)
  Top 0.254: IC49.8 IC18.12 126.36,70.48 125.73,69.85 IC9.12 v109.22,69.85 | IC40.17 v98.42,76.2
IBUS7  (via drill 0.3)  (2 unrouted)
  Top 0.254: IC49.9 IC18.11 126.36,69.21 125.73,68.58 IC9.11 | v90.81,77.47 IC40.18 | v90.81,78.74 89.53,78.74 88.9,79.38 70.48,79.38
  Bottom 0.254: v90.81,78.74 v90.81,77.47
IBUS8  (1 unrouted)
  Top 0.254: IC50.2 IC19.18 127.64,35.56 127,34.93 IC10.18 112.39,34.93 111.76,34.29 92.08,34.29 91.44,34.93 IC16.3
IBUS9  (via drill 0.3)
  Top 0.254: IC50.3 IC19.17 127.64,34.29 127,33.66 IC10.17 106.68,33.66 106.05,33.02 86.36,33.02 v85.72,33.66 IC16.4 | P2.30 51.44,90.8 v68.58,90.8 | v68.58,38.74 v85.72,38.74
  Bottom 0.254: v68.58,38.74 v68.58,90.8 | v85.72,38.74 v85.72,33.66
IBUS10  (1 unrouted)
  Top 0.254: IC50.4 IC19.16 127.64,33.02 127,32.38 IC10.16 106.68,32.38 106.05,31.75 87.63,31.75 85.72,29.84 IC16.7
IBUS11  (via drill 0.3)
  Top 0.254: IC50.5 IC19.15 127.64,31.75 127,31.11 IC10.15 107.95,31.11 107.31,30.48 87.63,30.48 85.72,28.57 IC16.8 v66.04,28.57 | P2.32 53.34,90.17 v67.94,90.17
  Bottom 0.254: v67.94,90.17 67.94,30.48 v66.04,28.57
IBUS12  (1 unrouted)
  Top 0.254: IC50.6 IC19.14 127.64,30.48 127,29.84 IC10.14 112.39,29.84 110.49,27.94 102.23,27.94 101.6,28.57 IC16.13
IBUS13  (via drill 0.3)
  Top 0.254: IC50.7 IC19.13 127.64,29.21 127,28.57 IC10.13 112.39,28.57 110.49,26.67 92.08,26.67 | 92.08,26.67 92.08,29.84 IC16.14 | P2.34 55.24,89.53 v67.31,89.53 | v64.77,27.3 81.92,27.3 82.55,26.67 92.08,26.67
  Bottom 0.254: v67.31,89.53 67.31,31.11 64.77,28.57 v64.77,27.3
IBUS14  (via drill 0.3)  (1 unrouted)
  Top 0.254: IC50.8 IC19.12 127.64,27.94 127,27.3 IC10.12 112.39,27.3 110.49,25.4 v91.44,25.4 | v91.44,33.66 IC16.17
  Bottom 0.254: v91.44,25.4 v91.44,33.66
IBUS15  (via drill 0.3)  (2 unrouted)
  Top 0.254: IC50.9 IC19.11 127.64,26.67 127,26.04 IC10.11 | P2.36 57.15,88.9 v66.67,88.9
  Bottom 0.254: v66.67,34.93 v66.67,88.9
IR0  (via drill 0.3)  (1 unrouted)
  Top 0.254: IC18.2 100.97,79.38 99.69,78.1 88.9,78.1 88.27,78.74 v84.45,78.74 IC40.2 | IC30.1 78.11,63.5 78.74,62.87 v83.82,62.87 93.98,62.87 94.61,62.23 IC32.2
  Bottom 0.254: IC42.2 26.04,30.23 31.75,30.23 31.75,34.29 31.11,34.93 31.11,54.61 | P1.7 83.82,79.38 v84.45,78.74 84.45,63.5 v83.82,62.87
IR1  (via drill 0.3)  (3 unrouted)
  Top 0.254: v85.09,78.1 87,78.1 88.27,76.83 99.69,76.83 100.97,78.1 IC18.3 | IC40.5 v85.09,74.93
  Bottom 0.254: v85.09,74.93 v85.09,78.1 85.09,86.36 P1.8 | IC42.3 27.3,30.86 30.48,30.86 30.48,53.98
IR2  (via drill 0.3)  (2 unrouted)
  Top 0.254: IC30.9 83.19,57.15 83.82,57.79 v87,57.79 93.98,57.79 94.61,58.42 99.06,58.42 100.33,59.69 IC32.4 | v86.36,73.66 IC40.6
  Bottom 0.254: 29.21,52.71 29.21,34.93 28.57,34.29 IC42.4 | P1.9 v86.36,73.66 86.36,58.42 v87,57.79
IR3  (via drill 0.3)  (2 unrouted)
  Top 0.254: IC30.12 82.55,60.96 83.19,61.6 v87.63,61.6 IC34.3 | IC40.9 85.72,69.85 86.36,70.48 v87.63,70.48
  Bottom 0.254: IC42.5 29.84,53.34 | P1.10 87.63,86.36 v87.63,70.48 v87.63,61.6
IR4  (4 unrouted)
IR5  (3 unrouted)
IR6  (3 unrouted)
IR7  (3 unrouted)
IR8  (2 unrouted)
  Top 0.254: IC16.2 91.44,36.2 92.08,36.83 IC19.2
IR9  (via drill 0.3)  (2 unrouted)
  Top 0.254: v86.36,35.56 IC19.3 | IC16.5 v86.36,32.38
  Bottom 0.254: v86.36,32.38 v86.36,35.56
IR10  (2 unrouted)
IR11  (via drill 0.3)  (1 unrouted)
  Top 0.254: CON3.9 v50.16,29.21
  Bottom 0.254: v50.16,29.21 IC17.5
IR12  (via drill 0.3)  (1 unrouted)
  Top 0.254: CON3.10 11.43,30.48 13.97,30.48 14.61,29.84 50.8,29.84 v51.44,29.21
  Bottom 0.254: v51.44,29.21 IC17.6
IR13  (via drill 0.3)  (1 unrouted)
  Top 0.254: CON3.11 13.97,31.75 15.24,30.48 51.44,30.48 v52.7,29.21
  Bottom 0.254: v52.7,29.21 IC17.7
IR14  (via drill 0.3)  (1 unrouted)
  Top 0.254: CON3.13 15.88,31.11 52.07,31.11 v53.98,29.21
  Bottom 0.254: v53.98,29.21 IC17.8
IR15  (2 unrouted)
N$1
  Top 0.254: IC13.11 99.69,46.99 98.42,48.26 IC13.3 94.61,48.26 93.34,49.53 83.19,49.53 82.86,49.85 IC14.4
N$2
  Bottom 0.254: IC1.4 15.84,76.17 D3.C
N$3
  Top 0.254: R16.2 59.69,30.48 60.96,29.21 IC5.4
N$4
  Top 0.254: R18.2 59.69,28.57 60.33,27.94 IC5.5
N$6
  Top 0.254: R19.2 IC5.6
N$7
  Top 0.254: R20.2 59.69,24.77 60.33,25.4 IC5.7
N$8  (1 unrouted)
N$9  (1 unrouted)
N$10
  Top 0.254: R14.2 21.59,78.1 JP2.2
  Bottom 0.254: JP2.10 JP2.8 JP2.6 JP2.4 JP2.2
N$15  (1 unrouted)
  Top 0.254: IC52.11 IC52.12
N$16
  Top 0.254: IC52.2 IC52.13
N$17
  Top 0.254: IC52.5 IC52.10
N$18  (1 unrouted)
  Top 0.254: IC52.6 IC52.9
N$19  (1 unrouted)
N$20  (via drill 0.3)
  Top 0.254: v141.6,48.26 IC52.3 | v141.6,43.18 IC52.8
  Bottom 0.254: v141.6,43.18 v141.6,48.26
N$21  (1 unrouted)
N$22
  Top 0.254: IC13.6 99.06,44.45 99.06,41.7 R69.2
N$23  (1 unrouted)
N$24
  Top 0.254: JP3.2 JP3.4 JP3.6 JP3.8 IC48.9
N$25  (1 unrouted)
  Top 0.254: IC13.1 98.42,50.8 99.69,49.53 IC13.13
N$26  (1 unrouted)
N$28  (1 unrouted)
N$33
  Top 0.254: S1.3 S1.4
  Bottom 0.254: S1.3 7.98,74.99 R10.1 6.35,76.47 C18.2 3.54,76.2 | JP1.2 6.78,83.82 S1.4 12.62,80.72 12.7,80.64 IC1.2
N$36  (via drill 0.3)
  Top 0.254: v34.92,71.75 38.1,71.75 38.73,71.12 IC8.7
  Bottom 0.254: v34.92,71.75 JP2.9
N$66
  Top 0.254: IC29.3 83.82,60.96 83.19,60.33 78.74,60.33 78.74,59.05 87,59.05 87.63,58.42 IC29.10
N$89  (1 unrouted)
N$90
  Top 0.254: IC29.6 IC29.9
N$93
  Top 0.254: IC32.3 108.58,60.96 108.58,58.42 IC32.5
N$94  (1 unrouted)
N$154  (via drill 0.3)
  Top 0.254: v32.38,72.39 IC8.6
  Bottom 0.254: v32.38,72.39 JP2.7
N$347
  Bottom 0.254: LED1.A R7.1
N$375  (via drill 0.3)
  Top 0.254: v29.84,73.66 IC8.5
  Bottom 0.254: v29.84,73.66 JP2.5
N$376
  Top 0.254: JP2.3 28.57,74.3 38.1,74.3 38.73,74.93 IC8.4
N$377
  Top 0.254: JP2.1 26.04,76.83 38.1,76.83 38.73,76.2 IC8.3
N$418  (1 unrouted)
N$458
  Top 0.254: IC25.7 27.3,41.28 27.94,40.64 36.2,40.64 36.2,38.74 IC27.9
N$459
  Top 0.254: IC25.9 IC27.8
N$460
  Top 0.254: IC25.10 IC27.7
N$461
  Top 0.254: IC25.11 IC27.6
N$463
  Top 0.254: IC25.12 IC27.5
N$464
  Top 0.254: IC25.13 IC27.4
N$465
  Top 0.254: IC25.14 IC27.3
N$466
  Top 0.254: IC25.15 IC27.2
N$483
  Top 0.254: IC26.15 IC28.2
N$484
  Top 0.254: IC26.14 IC28.3
N$485
  Top 0.254: IC26.13 IC28.4
N$486
  Top 0.254: IC26.12 IC28.5
N$487
  Top 0.254: IC26.11 IC28.6
N$488
  Top 0.254: IC26.10 IC28.7
N$505
  Top 0.254: IC26.9 IC28.8
N$506
  Top 0.254: IC26.7 27.3,57.79 27.94,57.15 36.2,57.15 36.2,55.25 IC28.9
N$732
  Bottom 0.254: LED4.A R26.1
N$733
  Bottom 0.254: LED3.A R25.1
N$739  (1 unrouted)
OP1_BRANCH  (1 unrouted)
OP2_ROLL  (1 unrouted)
OPIF0  (via drill 0.3)  (2 unrouted)
  Top 0.254: IC35.11 v89.53,45.09 | CON3.35 26.04,62.23 27.3,60.96 54.61,60.96
  Bottom 0.254: v89.53,45.09 89.53,53.34 | CON3.35 R46.2
OPIF1  (2 unrouted)
  Top 0.254: CON3.37 26.04,64.77 27.3,63.5 54.61,63.5
  Bottom 0.254: CON3.37 R45.2
OPIF2  (2 unrouted)
  Top 0.254: CON3.39 13.34,67.94 78.74,67.94
  Bottom 0.254: CON3.39 R44.2
OPIF3  (2 unrouted)
  Top 0.254: CON3.40 11.43,68.58 77.47,68.58
  Bottom 0.254: R43.2 CON3.40
PAGE0  (via drill 0.3)
  Top 0.254: v123.83,62.23 IC37.2 | IC19.4 v123.19,34.29
  Top 0.305: v123.83,62.23 126.36,62.23 127,62.87 R9.2
  Bottom 0.254: v123.19,34.29 123.19,40.64 122.56,41.28 122.56,47.62 123.83,48.9 v123.83,62.23
PAGE1  (via drill 0.3)
  Top 0.254: v123.19,58.42 IC37.5 | IC19.5 v122.56,33.02
  Top 0.305: v123.19,58.42 123.83,58.42 125.73,60.33 130.18,60.33 130.81,60.96 R8.2
  Bottom 0.254: v122.56,33.02 122.56,40.01 121.92,40.64 121.92,48.26 123.19,49.53 v123.19,58.42
PAGE2  (via drill 0.3)
  Top 0.254: v122.56,57.15 IC37.6 | IC19.6 v121.92,31.75
  Top 0.305: v122.56,57.15 123.83,57.15 125.73,59.05 R6.2
  Bottom 0.254: v121.92,31.75 121.92,39.37 121.28,40.01 121.28,48.9 122.56,50.17 v122.56,57.15
PAGE3  (via drill 0.3)
  Top 0.254: v121.92,53.34 IC37.9 | IC19.7 v121.28,30.48
  Top 0.305: v121.92,53.34 125.09,53.34 127,55.25 R5.2
  Bottom 0.254: v121.28,30.48 121.28,38.74 120.65,39.37 120.65,49.53 121.92,50.8 v121.92,53.34
PAGE4  (1 unrouted)
  Top 0.305: IC37.12 R2.2
PAGE5  (1 unrouted)
  Top 0.305: IC37.15 R1.2
PC10  (1 unrouted)
PC11  (1 unrouted)
PC12  (1 unrouted)
PC13  (1 unrouted)
PC14  (1 unrouted)
PC15  (1 unrouted)
POWERLED
  Bottom 0.254: LED2.A R11.1
POWEROK  (2 unrouted)
  Top 0.254: X1.30 24.13,15.24 D1.C
RUNIT0  (via drill 0.3)  (1 unrouted)
  Top 0.254: v27.3,48.9 IC25.1 | CON3.21 15.24,44.45 16.51,43.18 v27.3,43.18
  Bottom 0.254: CON3.21 R53.2 | v27.3,43.18 v27.3,48.9
RUNIT1  (via drill 0.3)  (1 unrouted)
  Top 0.254: v25.4,47.62 IC25.2 22.23,47.62 21.59,46.99 CON3.23
  Bottom 0.254: v25.4,47.62 26.04,48.26 26.04,51.44 | CON3.23 R52.2
RUNIT2  (via drill 0.3)  (1 unrouted)
  Top 0.254: 26.67,46.36 IC25.3 | 26.67,46.36 v27.94,46.36 | CON3.25 20.95,49.53 22.23,48.26 26.67,48.26 26.67,46.36
  Bottom 0.254: 28.57,52.07 28.57,46.99 v27.94,46.36 | CON3.25 R51.2
RUNIT3  (2 unrouted)
  Bottom 0.254: CON3.27 R50.2
SKIP0
  Top 0.254: IC6.4 119.72,18.41 IC36.2
SKIPMUXHI  (1 unrouted)
  Top 0.254: R22.2 IC35.5
SKIPMUXLO  (via drill 0.3)  (1 unrouted)
  Top 0.254: v88.27,59.05 IC34.5 | R23.2 103.19,18.73 IC7.1
  Bottom 0.254: 88.27,40.64 v88.27,59.05
SL  (1 unrouted)
SN
  Top 0.254: IC30.11 IC29.4
SV
  Top 0.254: IC30.3 77.47,60.96 78.11,61.6 81.92,61.6 82.55,62.23 IC29.2
SZ
  Top 0.254: IC29.5 83.19,58.42 82.55,57.79 78.74,57.79 78.74,55.88 IC30.8
VCC  (via drill 0.3)  (48 unrouted)
  Top 0.254: v102.23,36.2 IC10.2
  Bottom 0.254: v38.1,7.62 R3.2 | v141.6,76.2 R21.1 | IC42.20 24.77,23.5 25.4,24.13 v25.4,25.4 | v141.6,20.95 R24.2 | IC31.5 93.67,53.98 v93.98,53.98 | 99.72,9.84 100.97,9.84 v100.97,9.53 | R67.2 v15.88,94.61 | R10.2 8.68,78.32 v8.89,78.1 | IC1.5 11.75,74.61 v12.06,74.3 | IC17.20 v45.09,24.13 | v102.23,36.2 v102.23,34.93 v102.23,33.66 v102.23,32.38 v102.23,31.11 v102.23,29.84 v102.23,27.3 v102.23,24.13
  Bottom 0.61: R33.2 R32.2 R31.2 R30.2 v3.81,62.23 | R33.2 R34.2 R35.2 R36.2 | R36.2 R37.2 R38.2 R39.2 | R39.2 R40.2 R41.2 R42.2 v3.81,31.75 | R33.2 v3.81,54.61 | R36.2 v3.81,46.99 | R39.2 v3.81,39.37
  pour Top (isolate 0.254, rank 6): 0,101.6 160.66,101.6 160.66,0.64 0,0.64
WAITING  (1 unrouted)
WUNIT0  (via drill 0.3)
  Top 0.254: v19.05,65.41 IC26.1 | CON3.29 v19.05,54.61
  Bottom 0.254: CON3.29 R49.2 | v19.05,54.61 v19.05,65.41
WUNIT1  (via drill 0.3)
  Top 0.254: v25.4,64.14 IC26.2 | CON3.31 v26.67,57.15
  Bottom 0.254: CON3.31 R48.2 | v25.4,64.14 25.4,61.6 24.77,60.96 24.77,59.05 v26.67,57.15
WUNIT2  (via drill 0.3)
  Top 0.254: v19.68,62.87 IC26.3 | CON3.33 v19.68,59.69
  Bottom 0.254: CON3.33 R47.2 | v19.68,59.69 v19.68,62.87
÷2  (1 unrouted)
÷4  (1 unrouted)
  Top 0.254: IC5.3 IC5.14

## Text on the board
bNames: CLK | PWR